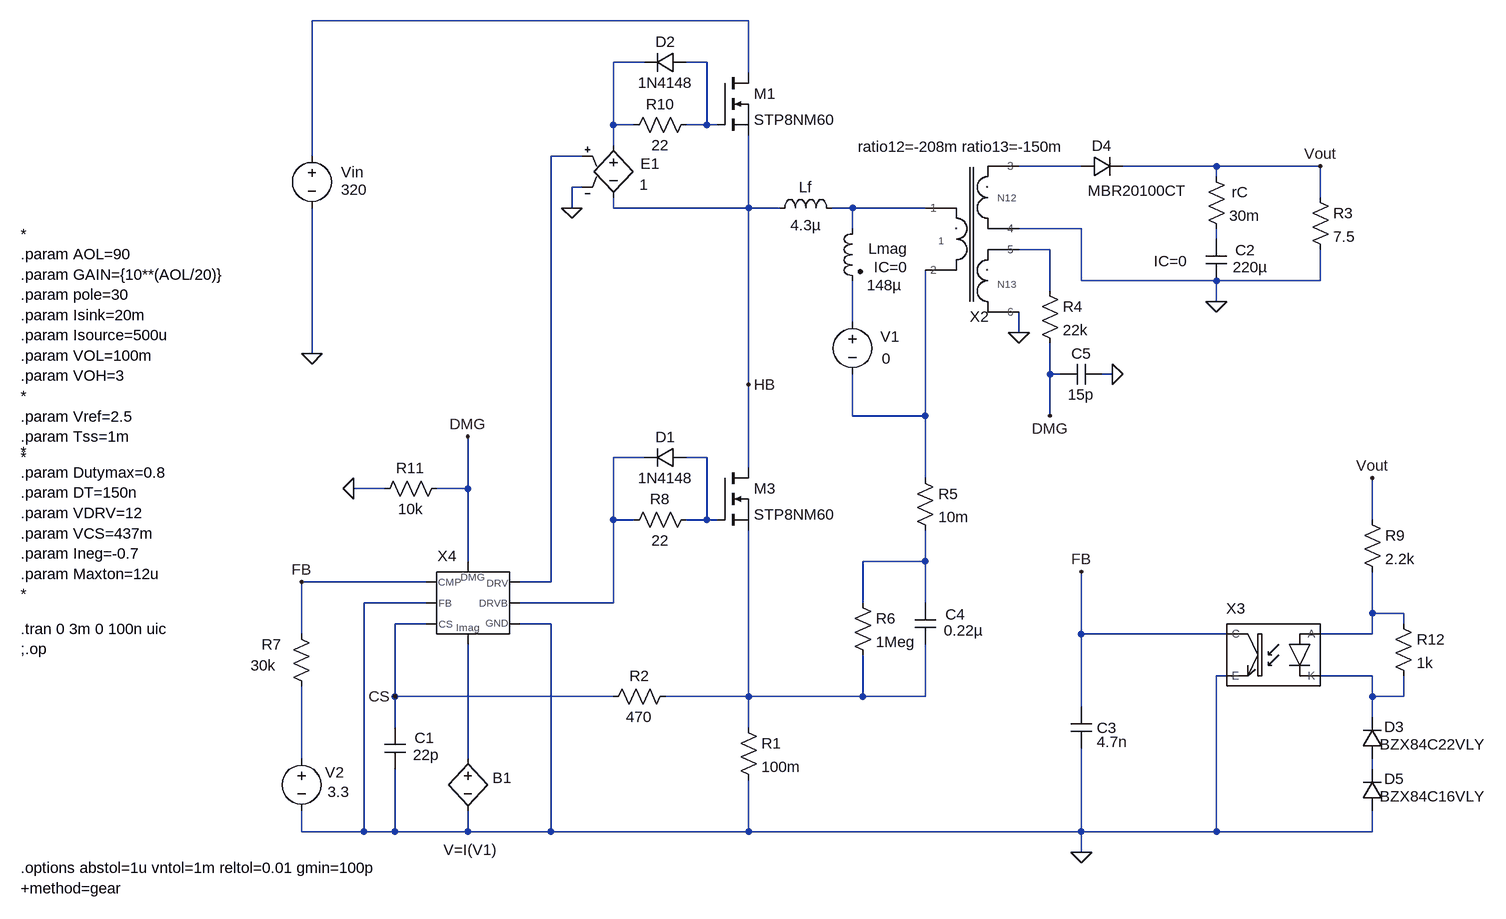
[diagram p0: schematic Flyback CM - AHB - isolated Zener - 45 V - MOSFETs - cbc.asc]
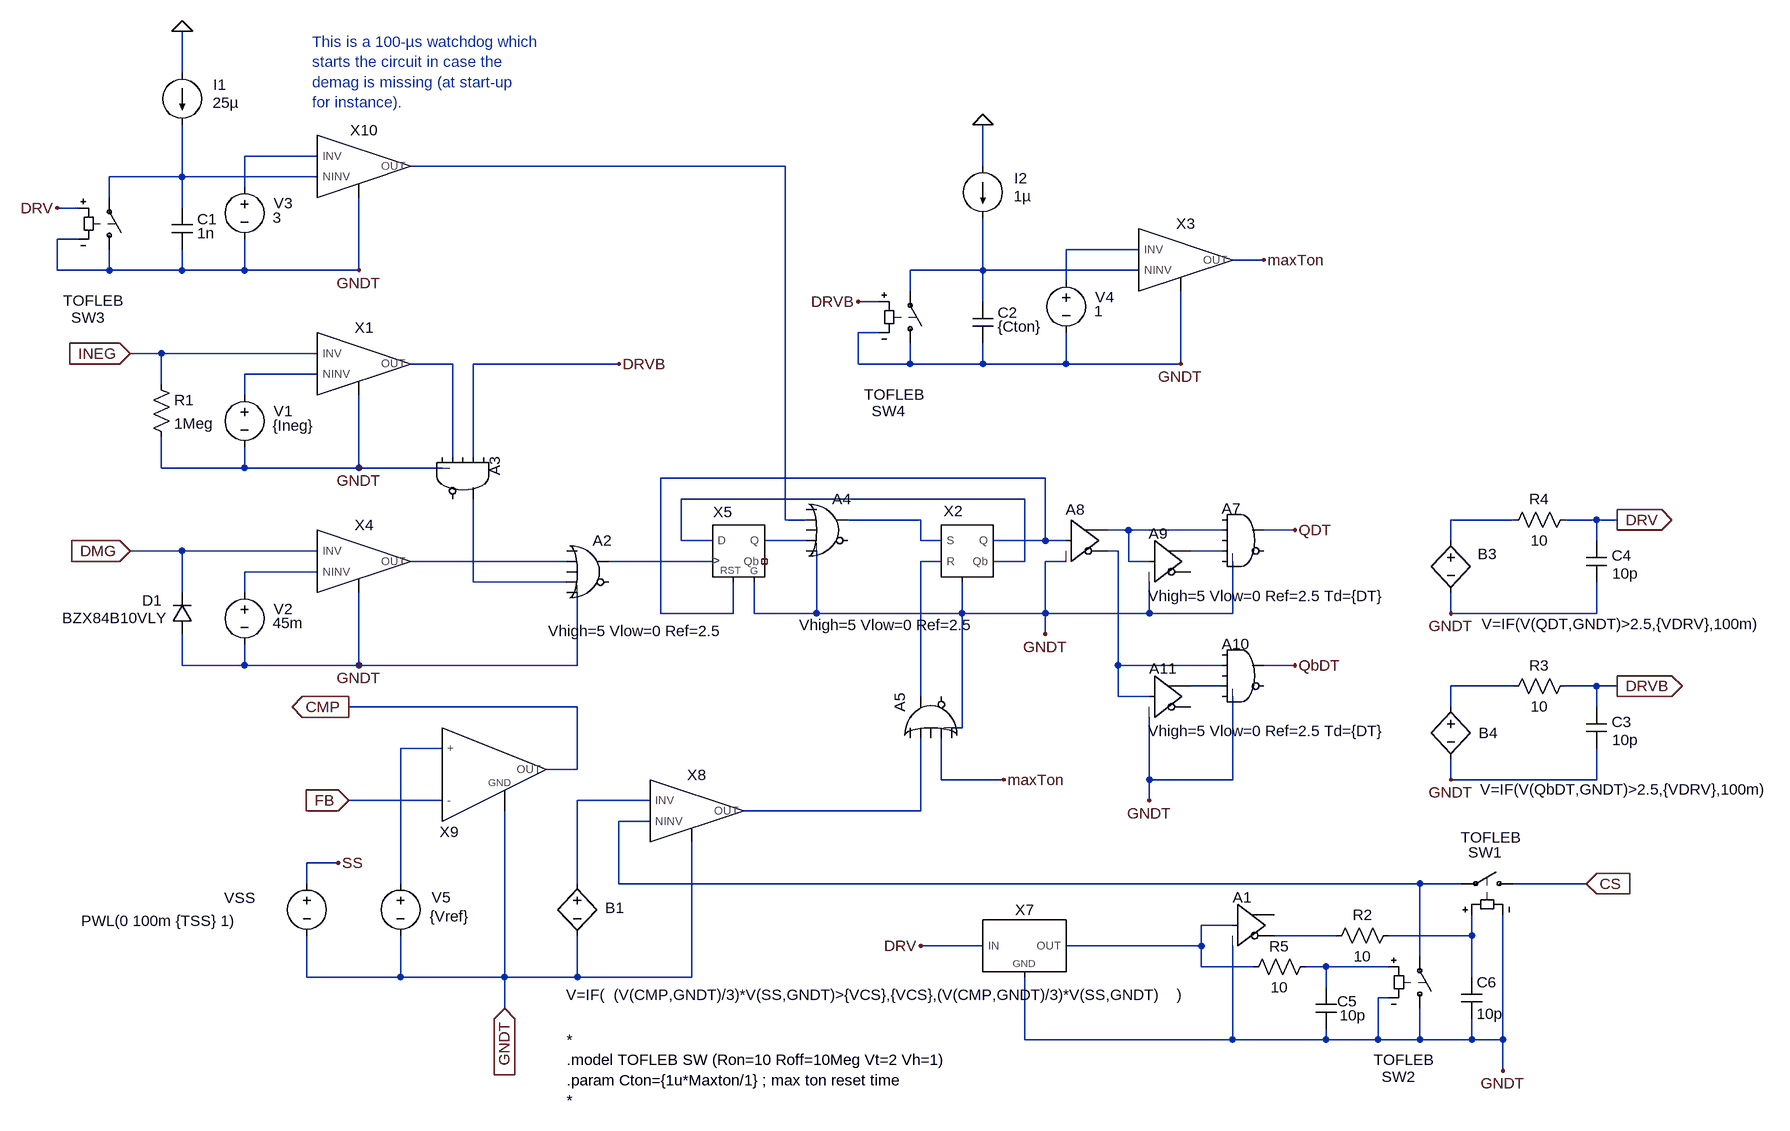
[diagram p1: sub-circuit generic_cm_qr_ahb_pwm.asc]
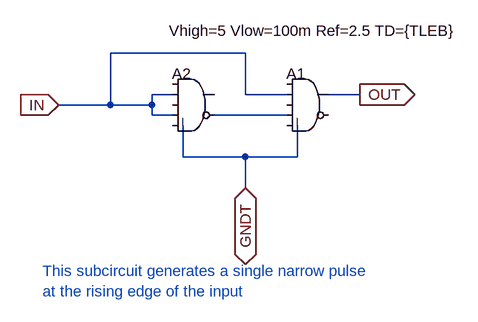
[diagram p2: sub-circuit small_pulse_leb.asc]
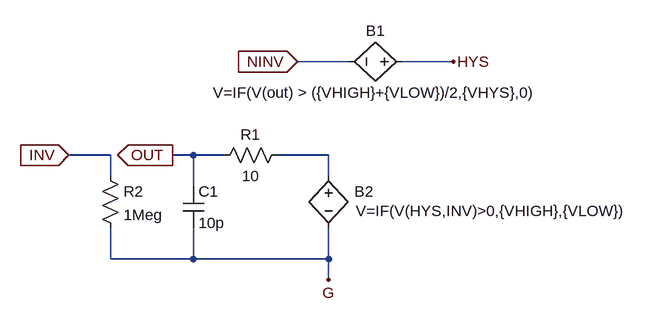
[diagram p3: sub-circuit comptof_g.asc]
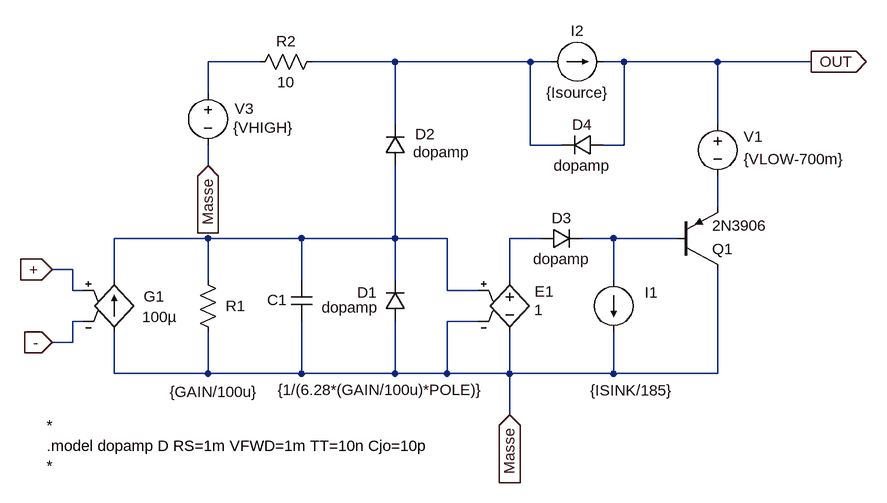
[diagram p4: sub-circuit op_amp_fan_out.asc]
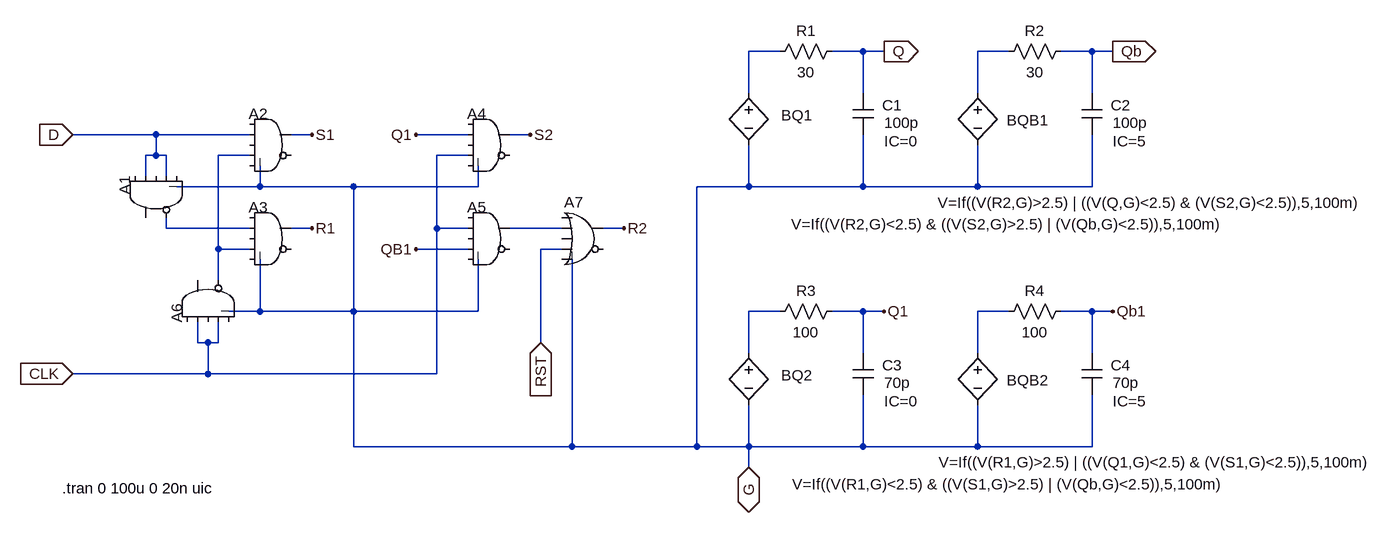
[diagram p5: sub-circuit d_flipflop_g_rst.asc]
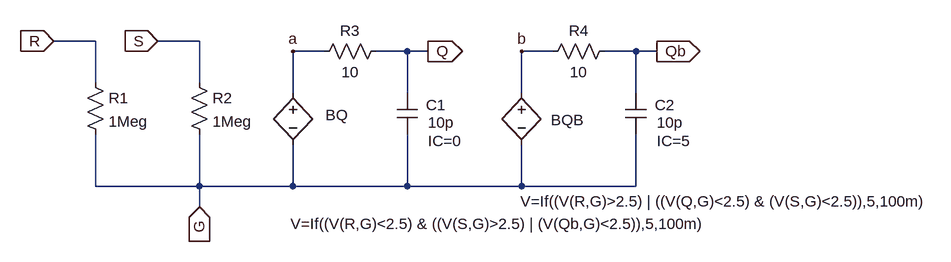
[diagram p6: sub-circuit sr_latch_g.asc]
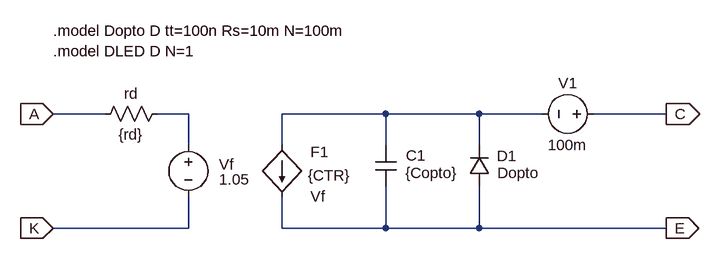
[diagram p7: sub-circuit optotof.asc]
Flyback CM - AHB - isolated Zener - 45 V - MOSFETs - cbc.asc, the LTspice schematic file:
Version 4.1
SHEET 1 3452 1760
WIRE 176 -512 -496 -512
WIRE 16 -448 -32 -448
WIRE 112 -448 80 -448
WIRE 176 -432 176 -512
WIRE -32 -352 -32 -448
WIRE 0 -352 -32 -352
WIRE 112 -352 112 -448
WIRE 112 -352 80 -352
WIRE 128 -352 112 -352
WIRE -32 -320 -32 -352
WIRE -496 -304 -496 -512
WIRE -80 -304 -128 -304
WIRE 688 -288 592 -288
WIRE 896 -288 752 -288
WIRE 1056 -288 896 -288
WIRE 896 -272 896 -288
WIRE -80 -256 -96 -256
WIRE 1056 -240 1056 -288
WIRE -96 -224 -96 -256
WIRE -32 -224 -32 -240
WIRE 176 -224 176 -336
WIRE 176 -224 -32 -224
WIRE 224 -224 176 -224
WIRE 336 -224 304 -224
WIRE 448 -224 336 -224
WIRE 336 -192 336 -224
WIRE 688 -192 592 -192
WIRE 896 -176 896 -192
WIRE 640 -160 592 -160
WIRE 688 -112 688 -192
WIRE 896 -112 688 -112
WIRE 1056 -112 1056 -160
WIRE 1056 -112 896 -112
WIRE 640 -96 640 -160
WIRE 896 -80 896 -112
WIRE 336 -48 336 -112
WIRE 592 -32 592 -64
WIRE -496 0 -496 -224
WIRE 640 32 640 -16
WIRE 656 32 640 32
WIRE 736 32 720 32
WIRE 176 48 176 -224
WIRE 336 96 336 32
WIRE 448 96 448 -128
WIRE 448 96 336 96
WIRE 640 96 640 32
WIRE 16 160 -32 160
WIRE 112 160 80 160
WIRE 176 176 176 48
WIRE 448 192 448 96
WIRE -384 208 -432 208
WIRE -256 208 -256 128
WIRE -256 208 -304 208
WIRE -32 256 -32 160
WIRE 0 256 -32 256
WIRE 112 256 112 160
WIRE 112 256 80 256
WIRE 128 256 112 256
WIRE 1136 256 1136 192
WIRE -256 320 -256 208
WIRE 448 320 448 272
WIRE 448 320 352 320
WIRE -320 352 -512 352
WIRE -128 352 -128 -304
WIRE -128 352 -176 352
WIRE -320 384 -416 384
WIRE -32 384 -32 256
WIRE -32 384 -176 384
WIRE 352 384 352 320
WIRE 448 384 448 320
WIRE 1136 400 1136 336
WIRE 1184 400 1136 400
WIRE -320 416 -368 416
WIRE -128 416 -176 416
WIRE 1184 416 1184 400
WIRE -512 432 -512 352
WIRE 688 432 688 336
WIRE 912 432 688 432
WIRE 1136 432 1136 400
WIRE 1136 432 1056 432
WIRE 912 496 896 496
WIRE 1136 496 1056 496
WIRE -368 528 -368 416
WIRE -32 528 -368 528
WIRE 176 528 176 272
WIRE 176 528 48 528
WIRE 352 528 352 464
WIRE 352 528 176 528
WIRE 448 528 448 448
WIRE 448 528 352 528
WIRE 1136 528 1136 496
WIRE 1184 528 1184 496
WIRE 1184 528 1136 528
WIRE 688 544 688 432
WIRE 1136 560 1136 528
WIRE -368 576 -368 528
WIRE 176 576 176 528
WIRE -512 624 -512 512
WIRE -256 624 -256 448
WIRE 1136 640 1136 624
WIRE -512 736 -512 704
WIRE -416 736 -416 384
WIRE -416 736 -512 736
WIRE -368 736 -368 640
WIRE -368 736 -416 736
WIRE -256 736 -256 704
WIRE -256 736 -368 736
WIRE -128 736 -128 416
WIRE -128 736 -256 736
WIRE 176 736 176 656
WIRE 176 736 -128 736
WIRE 688 736 688 608
WIRE 688 736 176 736
WIRE 896 736 896 496
WIRE 896 736 688 736
WIRE 1136 736 1136 704
WIRE 1136 736 896 736
WIRE 688 768 688 736
FLAG 896 -80 0
FLAG -496 0 0
FLAG 1056 -288 Vout
FLAG 688 768 0
FLAG 688 336 FB
FLAG -512 352 FB
FLAG 592 -32 0
FLAG 640 96 DMG
FLAG -256 128 DMG
FLAG 736 32 0
FLAG 176 48 HB
FLAG -368 528 CS
FLAG -432 208 0
FLAG -96 -224 0
FLAG 1136 192 Vout
SYMBOL ind2 352 -208 M0
WINDOW 0 -69 47 Left 2
WINDOW 3 -60 103 Left 2
WINDOW 123 -69 75 Left 2
SYMATTR InstName Lmag
SYMATTR Value 148µ
SYMATTR Value2 IC=0
SYMATTR Type ind
SYMBOL res 880 -288 R0
WINDOW 0 40 40 Left 2
SYMATTR InstName rC
SYMATTR Value 30m
SYMBOL cap 880 -176 R0
WINDOW 0 45 17 Left 2
WINDOW 3 41 43 Left 2
WINDOW 123 -80 34 Left 2
SYMATTR InstName C2
SYMATTR Value 220µ
SYMATTR Value2 IC=0
SYMBOL res 1040 -256 R0
SYMATTR InstName R3
SYMATTR Value 7.5
SYMBOL voltage -496 -320 R0
WINDOW 0 45 41 Left 2
WINDOW 3 45 68 Left 2
SYMATTR InstName Vin
SYMATTR Value 320
SYMBOL res 432 176 R0
SYMATTR InstName R5
SYMATTR Value 10m
SYMBOL ind 208 -208 R270
WINDOW 0 32 56 VTop 2
WINDOW 3 5 56 VBottom 2
SYMATTR InstName Lf
SYMATTR Value 4.3µ
SYMBOL voltage -512 608 R0
WINDOW 0 36 37 Left 2
WINDOW 3 40 67 Left 2
SYMATTR InstName V2
SYMATTR Value 3.3
SYMBOL res -528 416 R0
WINDOW 3 -62 64 Left 2
WINDOW 0 -45 32 Left 2
SYMATTR Value 30k
SYMATTR InstName R7
SYMBOL cap 672 544 R0
WINDOW 0 40 32 Left 2
WINDOW 3 40 54 Left 2
SYMATTR InstName C3
SYMATTR Value 4.7n
SYMBOL diode 688 -272 R270
WINDOW 0 32 32 VTop 2
WINDOW 3 -6 87 VBottom 2
SYMATTR InstName D4
SYMATTR Value MBR20100CT
SYMBOL res 160 560 R0
SYMATTR InstName R1
SYMATTR Value 100m
SYMBOL res 64 512 R90
WINDOW 0 0 56 VBottom 2
WINDOW 3 32 56 VTop 2
SYMATTR InstName R2
SYMATTR Value 470
SYMBOL cap -384 576 R0
WINDOW 0 46 16 Left 2
WINDOW 3 44 42 Left 2
SYMATTR InstName C1
SYMATTR Value 22p
SYMBOL res 624 -112 R0
SYMATTR InstName R4
SYMATTR Value 22k
SYMBOL cap 720 16 R90
WINDOW 0 0 32 VBottom 2
WINDOW 3 32 32 VTop 2
SYMATTR InstName C5
SYMATTR Value 15p
SYMBOL voltage 336 -64 R0
WINDOW 0 43 38 Left 2
WINDOW 3 45 72 Left 2
SYMATTR InstName V1
SYMATTR Value 0
SYMBOL bv -256 608 R0
WINDOW 0 38 45 Left 2
WINDOW 3 -37 156 Left 2
SYMATTR InstName B1
SYMATTR Value V=I(V1)
SYMBOL nmos 128 -432 R0
SYMATTR InstName M1
SYMATTR Value STP8NM60
SYMBOL res 96 240 R90
WINDOW 0 0 56 VBottom 2
WINDOW 3 32 56 VTop 2
SYMATTR InstName R8
SYMATTR Value 22
SYMBOL diode 80 176 M270
WINDOW 0 32 32 VTop 2
WINDOW 3 0 32 VBottom 2
SYMATTR InstName D1
SYMATTR Value 1N4148
SYMBOL res 96 -368 R90
WINDOW 0 0 56 VBottom 2
WINDOW 3 32 56 VTop 2
SYMATTR InstName R10
SYMATTR Value 22
SYMBOL diode 80 -432 M270
WINDOW 0 32 32 VTop 2
WINDOW 3 0 32 VBottom 2
SYMATTR InstName D2
SYMATTR Value 1N4148
SYMBOL e -32 -336 R0
WINDOW 0 42 44 Left 2
WINDOW 3 40 76 Left 2
SYMATTR InstName E1
SYMATTR Value 1
SYMBOL nmos 128 176 R0
SYMATTR InstName M3
SYMATTR Value STP8NM60
SYMBOL res -288 192 R90
WINDOW 0 0 56 VBottom 2
WINDOW 3 32 56 VTop 2
SYMATTR InstName R11
SYMATTR Value 10k
SYMBOL res 336 368 R0
SYMATTR InstName R6
SYMATTR Value 1Meg
SYMBOL cap 432 384 R0
WINDOW 0 47 18 Left 2
WINDOW 3 45 42 Left 2
SYMATTR InstName C4
SYMATTR Value 0.22µ
SYMBOL res 1120 240 R0
SYMATTR InstName R9
SYMATTR Value 2.2k
SYMBOL res 1168 400 R0
SYMATTR InstName R12
SYMATTR Value 1k
SYMBOL diode 1152 624 R180
WINDOW 0 -33 49 Left 2
WINDOW 3 -158 22 Left 2
SYMATTR InstName D3
SYMATTR Value BZX84C22VLY
SYMBOL diode 1152 704 R180
WINDOW 0 -33 49 Left 2
WINDOW 3 -158 22 Left 2
SYMATTR InstName D5
SYMATTR Value BZX84C16VLY
SYMBOL TOF\\Subcircuits\\Generic_CM_QR_AHB_PWM -256 352 R0
WINDOW 0 -32 -25 Bottom 2
SYMATTR InstName X4
SYMATTR SpiceLine gain={gain} pole={pole} Isink={Isink} Isource={Isource} Vlow={VOL} Vhigh={VOH} Ineg={Ineg} Maxton={Maxton}
SYMBOL TOF\\Subcircuits\\optoTOF 944 464 M0
WINDOW 0 18 -56 Bottom 2
SYMATTR InstName X3
SYMATTR SpiceLine Copto=450p Rd=150 CTR=0.33
SYMBOL TOF\\Subcircuits\\XFMR_3W 480 -272 R0
WINDOW 0 51 231 Bottom 2
WINDOW 39 25 -31 Bottom 2
SYMATTR InstName X2
SYMATTR SpiceLine ratio12=-208m ratio13=-150m
TEXT -944 424 Left 2 !.tran 0 3m 0 100n uic\n;.op
TEXT -944 -184 Left 2 !* \n.param AOL=90\n.param GAIN={10**(AOL/20)}\n.param pole=30\n.param Isink=20m\n.param Isource=500u\n.param VOL=100m\n.param VOH=3\n*\n.param Vref=2.5\n.param Tss=1m\n*
TEXT -944 152 Left 2 !*\n.param Dutymax=0.8\n.param DT=150n\n.param VDRV=12\n.param VCS=437m\n.param Ineg=-0.7\n.param Maxton=12u\n*
TEXT -944 792 Left 2 !.options abstol=1u vntol=1m reltol=0.01 gmin=100p\n+method=gear

generic_cm_qr_ahb_pwm.asc, the sub-circuit schematic file:
Version 4.1
SHEET 1 1744 1808
WIRE -1456 128 -1456 64
WIRE -1248 256 -1360 256
WIRE -528 272 -1104 272
WIRE -224 272 -224 208
WIRE -1456 288 -1456 208
WIRE -1456 288 -1568 288
WIRE -1248 288 -1456 288
WIRE -1360 304 -1360 256
WIRE -1568 320 -1568 288
WIRE -1616 336 -1648 336
WIRE -1456 336 -1456 288
WIRE -1616 384 -1648 384
WIRE 16 400 -96 400
WIRE 208 416 160 416
WIRE -1648 432 -1648 384
WIRE -1568 432 -1568 400
WIRE -1568 432 -1648 432
WIRE -1456 432 -1456 400
WIRE -1456 432 -1568 432
WIRE -1360 432 -1360 384
WIRE -1360 432 -1456 432
WIRE -1184 432 -1184 320
WIRE -1184 432 -1360 432
WIRE -224 432 -224 352
WIRE -224 432 -336 432
WIRE 16 432 -224 432
WIRE -96 448 -96 400
WIRE -336 464 -336 432
WIRE -384 480 -416 480
WIRE -224 480 -224 432
WIRE -384 528 -416 528
WIRE -1488 560 -1536 560
WIRE -1248 560 -1488 560
WIRE -1040 576 -1104 576
WIRE -784 576 -1008 576
WIRE -416 576 -416 528
WIRE -336 576 -336 544
WIRE -336 576 -416 576
WIRE -224 576 -224 544
WIRE -224 576 -336 576
WIRE -96 576 -96 528
WIRE -96 576 -224 576
WIRE 80 576 80 464
WIRE 80 576 -96 576
WIRE -1248 592 -1360 592
WIRE -1488 608 -1488 560
WIRE -1360 624 -1360 592
WIRE -1040 720 -1040 576
WIRE -1008 720 -1008 576
WIRE -1488 736 -1488 688
WIRE -1360 736 -1360 704
WIRE -1360 736 -1488 736
WIRE -1184 736 -1184 624
WIRE -1184 736 -1360 736
WIRE -1056 736 -1184 736
WIRE -128 752 -720 752
WIRE -160 784 -688 784
WIRE -528 816 -528 272
WIRE -496 816 -528 816
WIRE -320 816 -432 816
WIRE 592 816 496 816
WIRE 720 816 672 816
WIRE 752 816 720 816
WIRE 0 832 -32 832
WIRE 144 832 0 832
WIRE 256 832 208 832
WIRE -688 848 -688 784
WIRE -640 848 -688 848
WIRE -496 848 -560 848
WIRE -320 848 -320 816
WIRE -288 848 -320 848
WIRE -128 848 -128 752
WIRE -128 848 -208 848
WIRE -96 848 -128 848
WIRE 496 848 496 816
WIRE 720 848 720 816
WIRE -1456 864 -1536 864
WIRE -1248 864 -1456 864
WIRE -16 864 -32 864
WIRE 144 864 96 864
WIRE -864 880 -1104 880
WIRE -640 880 -800 880
WIRE -288 880 -320 880
WIRE -160 880 -160 784
WIRE -160 880 -208 880
WIRE -96 880 -128 880
WIRE 0 880 0 832
WIRE 32 880 0 880
WIRE -1248 896 -1360 896
WIRE -1008 912 -1008 784
WIRE -864 912 -1008 912
WIRE -1456 928 -1456 864
WIRE -1360 928 -1360 896
WIRE -720 960 -720 752
WIRE -608 960 -608 912
WIRE -608 960 -720 960
WIRE -576 960 -576 912
WIRE -480 960 -480 864
WIRE -480 960 -576 960
WIRE -256 960 -256 912
WIRE -256 960 -480 960
WIRE -128 960 -128 880
WIRE -128 960 -256 960
WIRE 32 960 32 912
WIRE 32 960 -128 960
WIRE 160 960 160 880
WIRE 160 960 32 960
WIRE 496 960 496 928
WIRE 720 960 720 912
WIRE 720 960 496 960
WIRE -128 992 -128 960
WIRE -1456 1040 -1456 992
WIRE -1360 1040 -1360 1008
WIRE -1360 1040 -1456 1040
WIRE -1184 1040 -1184 928
WIRE -1184 1040 -1360 1040
WIRE -848 1040 -848 928
WIRE -848 1040 -1184 1040
WIRE -16 1040 -16 864
WIRE 144 1040 -16 1040
WIRE 256 1040 208 1040
WIRE 144 1072 96 1072
WIRE 592 1072 496 1072
WIRE 720 1072 672 1072
WIRE 752 1072 720 1072
WIRE -320 1088 -320 880
WIRE -16 1088 -16 1040
WIRE 32 1088 -16 1088
WIRE -848 1104 -1200 1104
WIRE 496 1104 496 1072
WIRE 720 1104 720 1072
WIRE -256 1136 -256 960
WIRE -256 1136 -272 1136
WIRE -1056 1168 -1120 1168
WIRE -848 1200 -848 1104
WIRE -848 1200 -896 1200
WIRE -288 1216 -288 1152
WIRE -192 1216 -288 1216
WIRE 32 1216 32 1120
WIRE 160 1216 160 1088
WIRE 160 1216 32 1216
WIRE 496 1216 496 1184
WIRE 720 1216 720 1168
WIRE 720 1216 496 1216
WIRE -1056 1248 -1200 1248
WIRE -736 1248 -848 1248
WIRE 32 1248 32 1216
WIRE -320 1264 -320 1152
WIRE -320 1264 -592 1264
WIRE -736 1280 -784 1280
WIRE -1216 1344 -1264 1344
WIRE -1264 1376 -1264 1344
WIRE -1120 1376 -1120 1168
WIRE -848 1376 -848 1248
WIRE -784 1376 -784 1280
WIRE 448 1376 -784 1376
WIRE 512 1376 448 1376
WIRE 704 1376 592 1376
WIRE 160 1440 112 1440
WIRE 320 1456 224 1456
WIRE 528 1456 528 1424
WIRE 528 1456 400 1456
WIRE -224 1472 -320 1472
WIRE 112 1472 112 1440
WIRE 112 1472 -96 1472
WIRE 448 1488 448 1376
WIRE 112 1504 112 1472
WIRE 192 1504 112 1504
WIRE 304 1504 272 1504
WIRE 400 1504 304 1504
WIRE -1264 1520 -1264 1456
WIRE -1120 1520 -1120 1456
WIRE -1120 1520 -1264 1520
WIRE -960 1520 -960 1264
WIRE -960 1520 -1120 1520
WIRE -848 1520 -848 1456
WIRE -848 1520 -960 1520
WIRE -672 1520 -672 1312
WIRE -672 1520 -848 1520
WIRE 528 1520 528 1456
WIRE 304 1536 304 1504
WIRE 400 1552 384 1552
WIRE -960 1568 -960 1520
WIRE -160 1616 -160 1520
WIRE 160 1616 160 1472
WIRE 160 1616 -160 1616
WIRE 304 1616 304 1600
WIRE 304 1616 160 1616
WIRE 384 1616 384 1552
WIRE 384 1616 304 1616
WIRE 448 1616 448 1568
WIRE 448 1616 384 1616
WIRE 528 1616 528 1584
WIRE 528 1616 448 1616
WIRE 576 1616 576 1424
WIRE 576 1616 528 1616
WIRE 576 1664 576 1616
FLAG 256 832 QDT
FLAG 256 1040 QbDT
FLAG 496 1216 GNDT
FLAG 496 960 GNDT
FLAG 752 1072 DRVB
IOPIN 752 1072 Out
FLAG 752 816 DRV
IOPIN 752 816 Out
FLAG -1200 1104 CMP
IOPIN -1200 1104 Out
FLAG -1200 1248 FB
IOPIN -1200 1248 In
FLAG 704 1376 CS
IOPIN 704 1376 In
FLAG -960 1568 GNDT
IOPIN -960 1568 In
FLAG 32 1248 GNDT
FLAG -128 992 GNDT
FLAG -1536 864 DMG
IOPIN -1536 864 In
FLAG -1184 1040 GNDT
FLAG 576 1664 GNDT
FLAG -320 1472 DRV
FLAG -1184 736 GNDT
FLAG -1536 560 INEG
IOPIN -1536 560 In
FLAG -784 576 DRVB
FLAG -1184 432 GNDT
FLAG -1456 64 0
FLAG -1648 336 DRV
FLAG -1216 1344 SS
FLAG 80 576 GNDT
FLAG -224 208 0
FLAG -416 480 DRVB
FLAG 208 416 maxTon
FLAG -192 1216 maxTon
SYMBOL Digital\\and 176 784 R0
WINDOW 0 -33 15 Left 2
SYMATTR InstName A7
SYMATTR SpiceLine Vhigh=5 Vlow=0 Ref=2.5
SYMBOL Digital\\buf -96 784 R0
WINDOW 0 -1 16 Left 2
SYMATTR InstName A8
SYMATTR SpiceLine Vhigh=5 Vlow=0 Ref=1.0
SYMBOL Digital\\buf 32 816 R0
WINDOW 0 -1 21 Left 2
WINDOW 39 -2 117 Left 2
SYMATTR InstName A9
SYMATTR SpiceLine Vhigh=5 Vlow=0 Ref=2.5 Td={DT}
SYMBOL Digital\\and 176 992 R0
WINDOW 0 -33 15 Left 2
SYMATTR InstName A10
SYMATTR SpiceLine Vhigh=5 Vlow=0 Ref=2.5
SYMBOL Digital\\buf 32 1024 R0
WINDOW 0 0 21 Left 2
WINDOW 39 -2 117 Left 2
SYMATTR InstName A11
SYMATTR SpiceLine Vhigh=5 Vlow=0 Ref=2.5 Td={DT}
SYMBOL bv 496 832 R0
WINDOW 0 41 37 Left 2
WINDOW 3 47 144 Left 2
SYMATTR InstName B3
SYMATTR Value V=IF(V(QDT,GNDT)>2.5,{VDRV},100m)
SYMBOL bv 496 1088 R0
WINDOW 0 43 56 Left 2
WINDOW 3 45 143 Left 2
SYMATTR InstName B4
SYMATTR Value V=IF(V(QbDT,GNDT)>2.5,{VDRV},100m)
SYMBOL res 688 1056 R90
WINDOW 0 0 56 VBottom 2
WINDOW 3 32 56 VTop 2
SYMATTR InstName R3
SYMATTR Value 10
SYMBOL cap 704 1104 R0
WINDOW 0 39 23 Left 2
WINDOW 3 40 51 Left 2
SYMATTR InstName C3
SYMATTR Value 10p
SYMBOL res 688 800 R90
WINDOW 0 0 56 VBottom 2
WINDOW 3 32 56 VTop 2
SYMATTR InstName R4
SYMATTR Value 10
SYMBOL cap 704 848 R0
WINDOW 0 39 23 Left 2
WINDOW 3 40 51 Left 2
SYMATTR InstName C4
SYMATTR Value 10p
SYMBOL voltage -1120 1360 R0
WINDOW 0 48 37 Left 2
WINDOW 3 45 66 Left 2
SYMATTR InstName V5
SYMATTR Value {Vref}
SYMBOL bv -848 1360 R0
WINDOW 0 43 53 Left 2
WINDOW 3 -17 187 Left 2
SYMATTR InstName B1
SYMATTR Value V=IF(  (V(CMP,GNDT)/3)*V(SS,GNDT)>{VCS},{VCS},(V(CMP,GNDT)/3)*V(SS,GNDT)    )
SYMBOL voltage -1360 912 R0
WINDOW 0 45 41 Left 2
WINDOW 3 43 63 Left 2
SYMATTR InstName V2
SYMATTR Value 45m
SYMBOL diode -1440 992 R180
WINDOW 0 47 52 Left 2
WINDOW 3 39 25 Left 2
SYMATTR InstName D1
SYMATTR Value BZX84B10VLY
SYMBOL sw 608 1376 M270
WINDOW 3 71 3 VRight 2
WINDOW 0 48 34 VRight 2
SYMATTR Value TOFLEB
SYMATTR InstName SW1
SYMBOL sw 448 1584 M180
WINDOW 3 23 -63 Right 2
WINDOW 0 -7 -89 Right 2
SYMATTR Value TOFLEB
SYMATTR InstName SW2
SYMBOL Digital\\buf 160 1376 R0
WINDOW 0 0 21 Left 2
SYMATTR InstName A1
SYMATTR SpiceLine Vhigh=5 Vlow=0 Ref=2.5
SYMBOL voltage -1360 608 R0
WINDOW 0 45 41 Left 2
WINDOW 3 43 63 Left 2
SYMATTR InstName V1
SYMATTR Value {Ineg}
SYMBOL res -1504 592 R0
SYMATTR InstName R1
SYMATTR Value 1Meg
SYMBOL Digital\\or -832 832 R0
WINDOW 39 -61 155 Left 2
SYMATTR SpiceLine Vhigh=5 Vlow=0 Ref=2.5
SYMATTR InstName A2
SYMBOL Digital\\and -960 752 R90
WINDOW 0 -33 15 Left 2
SYMATTR InstName A3
SYMATTR SpiceLine Vhigh=5 Vlow=0 Ref=2.5
SYMBOL Tof\\Subcircuits\\Small_pulse_LEB -160 1472 R0
SYMATTR InstName X7
SYMATTR SpiceLine Tleb=100n
SYMBOL voltage -1360 288 R0
WINDOW 0 45 41 Left 2
WINDOW 3 43 63 Left 2
SYMATTR InstName V3
SYMATTR Value 3
SYMBOL current -1456 128 R0
WINDOW 0 48 18 Left 2
WINDOW 3 47 46 Left 2
SYMATTR InstName I1
SYMATTR Value 25µ
SYMBOL cap -1472 336 R0
WINDOW 0 39 17 Left 2
WINDOW 3 39 39 Left 2
SYMATTR InstName C1
SYMATTR Value 1n
SYMBOL sw -1568 416 M180
WINDOW 3 23 -63 Right 2
WINDOW 0 -7 -89 Right 2
SYMATTR Value TOFLEB
SYMATTR InstName SW3
SYMBOL Digital\\or -464 768 R0
WINDOW 39 -43 210 Left 2
SYMATTR SpiceLine Vhigh=5 Vlow=0 Ref=2.5
SYMATTR InstName A4
SYMBOL voltage -1264 1360 R0
WINDOW 0 -127 38 Left 2
WINDOW 3 -347 73 Left 2
WINDOW 123 0 0 Left 0
WINDOW 39 0 0 Left 0
SYMATTR InstName VSS
SYMATTR Value PWL(0 100m {TSS} 1)
SYMBOL voltage -96 432 R0
WINDOW 0 45 41 Left 2
WINDOW 3 43 63 Left 2
SYMATTR InstName V4
SYMATTR Value 1
SYMBOL current -224 272 R0
WINDOW 0 48 18 Left 2
WINDOW 3 47 46 Left 2
SYMATTR InstName I2
SYMATTR Value 1µ
SYMBOL cap -240 480 R0
WINDOW 0 39 17 Left 2
WINDOW 3 39 39 Left 2
SYMATTR InstName C2
SYMATTR Value {Cton}
SYMBOL sw -336 560 M180
WINDOW 3 23 -63 Right 2
WINDOW 0 -7 -89 Right 2
SYMATTR Value TOFLEB
SYMATTR InstName SW4
SYMBOL Digital\\or -368 1120 R270
SYMATTR SpiceLine Vhigh=5 Vlow=0 Ref=2.5 Td=100n
SYMATTR InstName A5
SYMBOL res 416 1440 R90
WINDOW 0 0 56 VBottom 2
WINDOW 3 32 56 VTop 2
SYMATTR InstName R2
SYMATTR Value 10
SYMBOL res 288 1488 R90
WINDOW 0 0 56 VBottom 2
WINDOW 3 32 56 VTop 2
SYMATTR InstName R5
SYMATTR Value 10
SYMBOL cap 288 1536 R0
WINDOW 0 33 21 Left 2
WINDOW 3 37 43 Left 2
SYMATTR InstName C5
SYMATTR Value 10p
SYMBOL cap 512 1520 R0
SYMATTR InstName C6
SYMATTR Value 10p
SYMBOL TOF\\Subcircuits\\COMPTOF_G -1184 272 R0
SYMATTR InstName X10
SYMATTR SpiceLine VHIGH=5 VLOW=100m VHYS=10m
SYMBOL TOF\\Subcircuits\\COMPTOF_G -1184 576 R0
SYMATTR InstName X1
SYMATTR SpiceLine VHIGH=5 VLOW=100m VHYS=10m
SYMBOL TOF\\Subcircuits\\COMPTOF_G -1184 880 R0
SYMATTR InstName X4
SYMATTR SpiceLine VHIGH=5 VLOW=100m VHYS=20m
SYMBOL TOF\\Subcircuits\\COMPTOF_G 80 416 R0
SYMATTR InstName X3
SYMATTR SpiceLine VHIGH=5 VLOW=100m VHYS=10m
SYMBOL TOF\\Subcircuits\\COMPTOF_G -672 1264 R0
SYMATTR InstName X8
SYMATTR SpiceLine VHIGH=5 VLOW=100m VHYS=10m
SYMBOL TOF\\Subcircuits\\op_amp_fan_out -976 1200 R0
WINDOW 0 -69 112 Bottom 2
SYMATTR InstName X9
SYMATTR SpiceLine gain={gain} pole={pole} Isink={Isink} Isource={Isource} Vlow={VOL} Vhigh={VOH}
SYMBOL TOF\\Subcircuits\\D_FlipFlop_G_RST -608 864 R0
WINDOW 0 -16 -44 Bottom 2
SYMATTR InstName X5
SYMBOL TOF\\Subcircuits\\SR_latch_G -256 864 R0
WINDOW 0 -14 -46 Bottom 2
SYMATTR InstName X2
TEXT -864 1616 Left 2 !*\n.model TOFLEB SW (Ron=10 Roff=10Meg Vt=2 Vh=1)\n.param Cton={1u*Maxton/1} ; max ton reset time\n*
TEXT -1256 80 Left 2 ;This is a 100-µs watchdog which\nstarts the circuit in case the\ndemag is missing (at start-up\nfor instance).

small_pulse_leb.asc, the sub-circuit schematic file:
Version 4.1
SHEET 1 880 680
WIRE 16 64 -192 64
WIRE -96 128 -128 128
WIRE 16 128 16 64
WIRE 80 128 16 128
WIRE 192 128 144 128
WIRE -192 144 -192 64
WIRE -192 144 -272 144
WIRE -128 144 -128 128
WIRE -128 144 -192 144
WIRE -128 160 -128 144
WIRE -96 160 -128 160
WIRE 80 160 -32 160
WIRE -80 224 -80 176
WIRE 16 224 -80 224
WIRE 96 224 96 176
WIRE 96 224 16 224
WIRE 16 272 16 224
FLAG 16 272 GNDT
IOPIN 16 272 BiDir
FLAG 192 128 OUT
IOPIN 192 128 Out
FLAG -272 144 IN
IOPIN -272 144 In
SYMBOL Digital\\and 112 80 R0
WINDOW 0 -33 16 Left 2
SYMATTR InstName A1
SYMATTR SpiceLine Vhigh=5 Vlow=100m Ref=2.5
SYMBOL Digital\\and -64 80 R0
WINDOW 0 -33 16 Left 2
WINDOW 39 -38 -50 Left 2
SYMATTR InstName A2
SYMATTR SpiceLine Vhigh=5 Vlow=100m Ref=2.5 TD={TLEB}
TEXT -296 400 Left 2 ;This subcircuit generates a single narrow pulse\nat the rising edge of the input

comptof_g.asc, the sub-circuit schematic file:
Version 4.1
SHEET 1 880 680
WIRE 64 192 -16 192
WIRE 224 192 144 192
WIRE -304 336 -368 336
WIRE -176 336 -208 336
WIRE -128 336 -176 336
WIRE 32 336 -48 336
WIRE -304 368 -304 336
WIRE 32 368 32 336
WIRE -176 384 -176 336
WIRE -304 496 -304 448
WIRE -176 496 -176 448
WIRE -176 496 -304 496
WIRE 32 496 32 448
WIRE 32 496 -176 496
WIRE 32 528 32 496
FLAG -16 192 NINV
IOPIN -16 192 In
FLAG 224 192 HYS
FLAG -208 336 OUT
IOPIN -208 336 Out
FLAG -368 336 INV
IOPIN -368 336 In
FLAG 32 528 G
SYMBOL bv 160 192 R90
WINDOW 0 -32 56 VBottom 2
WINDOW 3 32 56 VTop 2
SYMATTR InstName B1
SYMATTR Value V=IF(V(out) > ({VHIGH}+{VLOW})/2,{VHYS},0)
SYMBOL bv 32 352 R0
WINDOW 0 40 40 Left 2
WINDOW 3 42 70 Left 2
SYMATTR InstName B2
SYMATTR Value V=IF(V(HYS,INV)>0,{VHIGH},{VLOW})
SYMBOL res -32 320 R90
WINDOW 0 0 56 VBottom 2
WINDOW 3 32 56 VTop 2
SYMATTR InstName R1
SYMATTR Value 10
SYMBOL cap -192 384 R0
SYMATTR InstName C1
SYMATTR Value 10p
SYMBOL res -320 352 R0
SYMATTR InstName R2
SYMATTR Value 1Meg

op_amp_fan_out.asc, the sub-circuit schematic file:
Version 4.1
SHEET 1 1504 680
WIRE 96 -224 16 -224
WIRE 304 -224 176 -224
WIRE 512 -224 304 -224
WIRE 544 -224 512 -224
WIRE 656 -224 624 -224
WIRE 800 -224 656 -224
WIRE 944 -224 800 -224
WIRE 16 -176 16 -224
WIRE 304 -128 304 -224
WIRE 800 -128 800 -224
WIRE 512 -96 512 -224
WIRE 560 -96 512 -96
WIRE 656 -96 656 -224
WIRE 656 -96 624 -96
WIRE 16 -64 16 -96
WIRE 800 0 800 -48
WIRE 16 48 -128 48
WIRE 160 48 16 48
WIRE 304 48 304 -64
WIRE 304 48 160 48
WIRE 384 48 304 48
WIRE 528 48 480 48
WIRE 640 48 592 48
WIRE 736 48 640 48
WIRE -192 96 -224 96
WIRE -128 112 -128 48
WIRE 16 112 16 48
WIRE 160 112 160 48
WIRE 304 112 304 48
WIRE 480 112 480 48
WIRE 640 112 640 48
WIRE -192 128 -192 96
WIRE -176 128 -192 128
WIRE 384 128 384 48
WIRE 432 128 384 128
WIRE -176 176 -192 176
WIRE 432 176 384 176
WIRE -192 208 -192 176
WIRE -192 208 -224 208
WIRE -128 256 -128 192
WIRE 16 256 16 192
WIRE 16 256 -128 256
WIRE 160 256 160 176
WIRE 160 256 16 256
WIRE 304 256 304 176
WIRE 304 256 160 256
WIRE 384 256 384 176
WIRE 384 256 304 256
WIRE 480 256 480 192
WIRE 480 256 384 256
WIRE 640 256 640 192
WIRE 640 256 480 256
WIRE 800 256 800 96
WIRE 800 256 640 256
WIRE 480 320 480 256
FLAG -224 96 +
IOPIN -224 96 In
FLAG -224 208 -
IOPIN -224 208 In
FLAG 944 -224 OUT
IOPIN 944 -224 Out
FLAG 480 320 Masse
IOPIN 480 320 In
FLAG 16 -64 Masse
IOPIN 16 -64 In
DATAFLAG 800 -16 ""
SYMBOL g -128 96 R0
WINDOW 0 45 41 Left 2
WINDOW 3 43 73 Left 2
SYMATTR InstName G1
SYMATTR Value 100µ
SYMBOL res 0 96 R0
WINDOW 0 43 56 Left 2
WINDOW 3 -43 188 Left 2
SYMATTR InstName R1
SYMATTR Value {GAIN/100u}
SYMBOL cap 144 112 R0
WINDOW 0 -37 31 Left 2
WINDOW 3 -21 169 Left 2
SYMATTR InstName C1
SYMATTR Value {1/(6.28*(GAIN/100u)*POLE)}
SYMBOL diode 320 176 R180
WINDOW 0 44 45 Left 2
WINDOW 3 41 22 Left 2
SYMATTR InstName D1
SYMATTR Value dopamp
SYMBOL e 480 96 R0
WINDOW 0 39 34 Left 2
WINDOW 3 38 62 Left 2
SYMATTR InstName E1
SYMATTR Value 1
SYMBOL diode 528 64 R270
WINDOW 0 32 32 VTop 2
WINDOW 3 0 32 VBottom 2
SYMATTR InstName D3
SYMATTR Value dopamp
SYMBOL current 640 112 R0
WINDOW 0 48 19 Left 2
WINDOW 3 -36 170 Left 2
SYMATTR InstName I1
SYMATTR Value {ISINK/185}
SYMBOL pnp 736 96 M180
SYMATTR InstName Q1
SYMATTR Value 2N3906
SYMBOL voltage 800 -144 R0
WINDOW 0 40 35 Left 2
WINDOW 3 40 70 Left 2
SYMATTR InstName V1
SYMATTR Value {VLOW-700m}
SYMBOL current 544 -224 R270
WINDOW 0 32 40 VTop 2
WINDOW 3 -32 40 VBottom 2
SYMATTR InstName I2
SYMATTR Value {Isource}
SYMBOL diode 624 -80 M270
WINDOW 0 32 32 VTop 2
WINDOW 3 0 32 VBottom 2
SYMATTR InstName D4
SYMATTR Value dopamp
SYMBOL voltage 16 -192 R0
WINDOW 0 41 40 Left 2
WINDOW 3 39 69 Left 2
SYMATTR InstName V3
SYMATTR Value {VHIGH}
SYMBOL diode 288 -64 M180
WINDOW 0 47 49 Left 2
WINDOW 3 44 21 Left 2
SYMATTR InstName D2
SYMATTR Value dopamp
SYMBOL res 192 -240 R90
WINDOW 0 0 56 VBottom 2
WINDOW 3 32 56 VTop 2
SYMATTR InstName R2
SYMATTR Value 10
TEXT -232 336 Left 2 !*\n.model dopamp D RS=1m VFWD=1m TT=10n Cjo=10p\n*

d_flipflop_g_rst.asc, the sub-circuit schematic file:
Version 4.1
SHEET 1 1472 916
WIRE 480 -288 432 -288
WIRE 608 -288 560 -288
WIRE 640 -288 608 -288
WIRE 832 -288 784 -288
WIRE 960 -288 912 -288
WIRE 992 -288 960 -288
WIRE 432 -224 432 -288
WIRE 608 -224 608 -288
WIRE 784 -224 784 -288
WIRE 960 -224 960 -288
WIRE -480 -160 -608 -160
WIRE -336 -160 -480 -160
WIRE -240 -160 -272 -160
WIRE 0 -160 -80 -160
WIRE 96 -160 64 -160
WIRE -480 -128 -480 -160
WIRE -480 -128 -496 -128
WIRE -464 -128 -480 -128
WIRE -336 -128 -384 -128
WIRE 0 -128 -48 -128
WIRE -496 -96 -496 -128
WIRE -464 -96 -464 -128
WIRE -320 -80 -320 -112
WIRE -320 -80 -448 -80
WIRE -176 -80 -320 -80
WIRE 16 -80 16 -112
WIRE 16 -80 -176 -80
WIRE 432 -80 432 -144
WIRE 432 -80 352 -80
WIRE 608 -80 608 -160
WIRE 608 -80 432 -80
WIRE 784 -80 784 -144
WIRE 784 -80 608 -80
WIRE 960 -80 960 -160
WIRE 960 -80 784 -80
WIRE -464 -16 -464 -32
WIRE -336 -16 -464 -16
WIRE -240 -16 -272 -16
WIRE -48 -16 -48 -128
WIRE 0 -16 -48 -16
WIRE 144 -16 64 -16
WIRE 240 -16 208 -16
WIRE -384 16 -384 -128
WIRE -336 16 -384 16
WIRE 0 16 -80 16
WIRE 144 16 112 16
WIRE -384 64 -384 16
WIRE -320 112 -320 32
WIRE -320 112 -368 112
WIRE -176 112 -176 -80
WIRE -176 112 -320 112
WIRE 16 112 16 32
WIRE 16 112 -176 112
WIRE 480 112 432 112
WIRE 608 112 560 112
WIRE 640 112 608 112
WIRE 832 112 784 112
WIRE 960 112 912 112
WIRE 992 112 960 112
WIRE -416 160 -416 128
WIRE -400 160 -416 160
WIRE -384 160 -384 128
WIRE -384 160 -400 160
WIRE 112 160 112 16
WIRE 432 176 432 112
WIRE 608 176 608 112
WIRE 784 176 784 112
WIRE 960 176 960 112
WIRE -400 208 -400 160
WIRE -400 208 -608 208
WIRE -48 208 -48 -16
WIRE -48 208 -400 208
WIRE -176 320 -176 112
WIRE 160 320 160 32
WIRE 160 320 -176 320
WIRE 352 320 352 -80
WIRE 352 320 160 320
WIRE 432 320 432 256
WIRE 432 320 352 320
WIRE 608 320 608 240
WIRE 608 320 432 320
WIRE 784 320 784 256
WIRE 784 320 608 320
WIRE 960 320 960 240
WIRE 960 320 784 320
WIRE 432 352 432 320
FLAG -608 -160 D
IOPIN -608 -160 In
FLAG -608 208 CLK
IOPIN -608 208 In
FLAG 96 -160 S2
FLAG 240 -16 R2
FLAG 640 -288 Q
IOPIN 640 -288 Out
FLAG 992 -288 Qb
IOPIN 992 -288 Out
FLAG -240 -160 S1
FLAG -240 -16 R1
FLAG -80 -160 Q1
FLAG -80 16 QB1
FLAG 640 112 Q1
FLAG 992 112 Qb1
FLAG 432 352 G
IOPIN 432 352 BiDir
FLAG 112 160 RST
IOPIN 112 160 In
SYMBOL Digital\\and -544 -64 M90
WINDOW 0 -33 16 Left 2
SYMATTR InstName A1
SYMATTR SpiceLine Vhigh=5 Vlow=100m Ref=2.5 TD=10n
SYMBOL bv 432 -240 R0
WINDOW 0 50 50 Left 2
WINDOW 3 65 218 Left 2
SYMATTR InstName BQ1
SYMATTR Value V=If((V(R2,G)<2.5) & ((V(S2,G)>2.5) | (V(Qb,G)<2.5)),5,100m)
SYMBOL res 576 -304 R90
WINDOW 0 0 56 VBottom 2
WINDOW 3 32 56 VTop 2
SYMATTR InstName R1
SYMATTR Value 30
SYMBOL cap 592 -224 R0
WINDOW 0 45 19 Left 2
WINDOW 3 48 46 Left 2
WINDOW 123 48 74 Left 2
SYMATTR InstName C1
SYMATTR Value 100p
SYMATTR Value2 IC=0
SYMBOL bv 784 -240 R0
WINDOW 0 45 58 Left 2
WINDOW 3 -61 185 Left 2
SYMATTR InstName BQB1
SYMATTR Value V=If((V(R2,G)>2.5) | ((V(Q,G)<2.5) & (V(S2,G)<2.5)),5,100m)
SYMBOL res 928 -304 R90
WINDOW 0 0 56 VBottom 2
WINDOW 3 32 56 VTop 2
SYMATTR InstName R2
SYMATTR Value 30
SYMBOL cap 944 -224 R0
WINDOW 0 45 19 Left 2
WINDOW 3 48 46 Left 2
WINDOW 123 48 74 Left 2
SYMATTR InstName C2
SYMATTR Value 100p
SYMATTR Value2 IC=5
SYMBOL bv 432 160 R0
WINDOW 0 50 50 Left 2
WINDOW 3 67 218 Left 2
SYMATTR InstName BQ2
SYMATTR Value V=If((V(R1,G)<2.5) & ((V(S1,G)>2.5) | (V(Qb,G)<2.5)),5,100m)
SYMBOL res 576 96 R90
WINDOW 0 0 56 VBottom 2
WINDOW 3 32 56 VTop 2
SYMATTR InstName R3
SYMATTR Value 100
SYMBOL cap 592 176 R0
WINDOW 0 45 19 Left 2
WINDOW 3 48 46 Left 2
WINDOW 123 48 74 Left 2
SYMATTR InstName C3
SYMATTR Value 70p
SYMATTR Value2 IC=0
SYMBOL bv 784 160 R0
WINDOW 0 45 58 Left 2
WINDOW 3 -60 184 Left 2
SYMATTR InstName BQB2
SYMATTR Value V=If((V(R1,G)>2.5) | ((V(Q1,G)<2.5) & (V(S1,G)<2.5)),5,100m)
SYMBOL res 928 96 R90
WINDOW 0 0 56 VBottom 2
WINDOW 3 32 56 VTop 2
SYMATTR InstName R4
SYMATTR Value 100
SYMBOL cap 944 176 R0
WINDOW 0 45 19 Left 2
WINDOW 3 48 46 Left 2
WINDOW 123 48 74 Left 2
SYMATTR InstName C4
SYMATTR Value 70p
SYMATTR Value2 IC=5
SYMBOL Digital\\and -304 -208 R0
WINDOW 0 -33 16 Left 2
SYMATTR InstName A2
SYMATTR SpiceLine Vhigh=5 Vlow=100m Ref=2.5 TD=10n
SYMBOL Digital\\and -304 -64 R0
WINDOW 0 -33 16 Left 2
SYMATTR InstName A3
SYMATTR SpiceLine Vhigh=5 Vlow=100m Ref=2.5 TD=10n
SYMBOL Digital\\and 32 -208 R0
WINDOW 0 -33 16 Left 2
SYMATTR InstName A4
SYMATTR SpiceLine Vhigh=5 Vlow=100m Ref=2.5 TD=10n
SYMBOL Digital\\and 32 -64 R0
WINDOW 0 -33 16 Left 2
SYMATTR InstName A5
SYMATTR SpiceLine Vhigh=5 Vlow=100m Ref=2.5 TD=10n
SYMBOL Digital\\and -464 96 R270
WINDOW 0 -33 16 Left 2
SYMATTR InstName A6
SYMATTR SpiceLine Vhigh=5 Vlow=100m Ref=2.5 TD=10n
SYMBOL Digital\\or 176 -64 R0
WINDOW 0 -28 8 Left 2
SYMATTR InstName A7
SYMATTR SpiceLine Vhigh=5 Vlow=0 Ref=2.5
TEXT -624 384 Left 2 !.tran 0 100u 0 20n uic

sr_latch_g.asc, the sub-circuit schematic file:
Version 4.1
SHEET 1 1168 680
WIRE -192 48 -256 48
WIRE -32 48 -96 48
WIRE 160 64 112 64
WIRE 288 64 240 64
WIRE 320 64 288 64
WIRE 512 64 464 64
WIRE 640 64 592 64
WIRE 672 64 640 64
WIRE -192 112 -192 48
WIRE -32 112 -32 48
WIRE 112 128 112 64
WIRE 288 128 288 64
WIRE 464 128 464 64
WIRE 640 128 640 64
WIRE -192 272 -192 192
WIRE -32 272 -32 192
WIRE -32 272 -192 272
WIRE 112 272 112 208
WIRE 112 272 -32 272
WIRE 288 272 288 192
WIRE 288 272 112 272
WIRE 464 272 464 208
WIRE 464 272 288 272
WIRE 640 272 640 192
WIRE 640 272 464 272
WIRE -32 304 -32 272
FLAG -256 48 R
IOPIN -256 48 In
FLAG -96 48 S
IOPIN -96 48 In
FLAG 320 64 Q
IOPIN 320 64 Out
FLAG 672 64 Qb
IOPIN 672 64 Out
FLAG 112 64 a
FLAG 464 64 b
FLAG -32 304 G
IOPIN -32 304 In
SYMBOL bv 112 112 R0
WINDOW 0 50 50 Left 2
WINDOW 3 -4 218 Left 2
SYMATTR InstName BQ
SYMATTR Value V=If((V(R,G)<2.5) & ((V(S,G)>2.5) | (V(Qb,G)<2.5)),5,100m)
SYMBOL res -208 96 R0
SYMATTR InstName R1
SYMATTR Value 1Meg
SYMBOL res -48 96 R0
SYMATTR InstName R2
SYMATTR Value 1Meg
SYMBOL res 256 48 R90
WINDOW 0 0 56 VBottom 2
WINDOW 3 32 56 VTop 2
SYMATTR InstName R3
SYMATTR Value 10
SYMBOL cap 272 128 R0
WINDOW 0 45 19 Left 2
WINDOW 3 48 46 Left 2
WINDOW 123 48 74 Left 2
SYMATTR InstName C1
SYMATTR Value 10p
SYMATTR Value2 IC=0
SYMBOL bv 464 112 R0
WINDOW 0 45 58 Left 2
WINDOW 3 -2 183 Left 2
SYMATTR InstName BQB
SYMATTR Value V=If((V(R,G)>2.5) | ((V(Q,G)<2.5) & (V(S,G)<2.5)),5,100m)
SYMBOL res 608 48 R90
WINDOW 0 0 56 VBottom 2
WINDOW 3 32 56 VTop 2
SYMATTR InstName R4
SYMATTR Value 10
SYMBOL cap 624 128 R0
WINDOW 0 45 19 Left 2
WINDOW 3 48 46 Left 2
WINDOW 123 48 74 Left 2
SYMATTR InstName C2
SYMATTR Value 10p
SYMATTR Value2 IC=5

optotof.asc, the sub-circuit schematic file:
Version 4
SHEET 1 892 680
WIRE -48 32 -128 32
WIRE 80 32 32 32
WIRE 384 32 224 32
WIRE 528 32 384 32
WIRE 624 32 528 32
WIRE 816 32 704 32
WIRE 80 80 80 32
WIRE 224 80 224 32
WIRE 384 80 384 32
WIRE 528 80 528 32
WIRE 80 208 80 160
WIRE 80 208 -128 208
WIRE 224 208 224 160
WIRE 384 208 384 144
WIRE 384 208 224 208
WIRE 528 208 528 144
WIRE 528 208 384 208
WIRE 816 208 528 208
FLAG -128 32 A
IOPIN -128 32 In
FLAG -128 208 K
IOPIN -128 208 In
FLAG 816 32 C
IOPIN 816 32 Out
FLAG 816 208 E
IOPIN 816 208 Out
SYMBOL f 224 80 R0
WINDOW 0 44 11 Left 2
WINDOW 3 40 47 Left 2
WINDOW 38 44 79 Left 2
SYMATTR InstName F1
SYMATTR Value {CTR}
SYMATTR SpiceModel Vf
SYMBOL res 48 16 R90
WINDOW 0 0 56 VBottom 2
WINDOW 3 32 56 VTop 2
SYMATTR InstName rd
SYMATTR Value {rd}
SYMBOL voltage 80 64 R0
WINDOW 0 47 46 Left 2
WINDOW 3 47 69 Left 2
WINDOW 123 0 0 Left 0
WINDOW 39 0 0 Left 0
SYMATTR InstName Vf
SYMATTR Value 1.05
SYMBOL voltage 720 32 R90
WINDOW 0 -32 56 VBottom 2
WINDOW 3 32 56 VTop 2
SYMATTR InstName V1
SYMATTR Value 100m
SYMBOL cap 368 80 R0
WINDOW 0 47 16 Left 2
WINDOW 3 46 43 Left 2
SYMATTR InstName C1
SYMATTR Value {Copto}
SYMBOL diode 512 144 M180
WINDOW 0 43 47 Left 2
WINDOW 3 44 21 Left 2
SYMATTR InstName D1
SYMATTR Value Dopto
TEXT -128 -96 Left 2 !.model Dopto D tt=100n Rs=10m N=100m\n.model DLED D N=1

xfmr_3w.asc, the sub-circuit schematic file:
Version 4.1
SHEET 1 880 680
WIRE 32 96 -48 96
WIRE 160 96 32 96
WIRE 368 96 304 96
WIRE 496 96 448 96
WIRE 624 96 576 96
WIRE 32 144 32 96
WIRE 160 144 160 96
WIRE 304 144 304 96
WIRE 32 288 32 224
WIRE 32 288 -48 288
WIRE 160 288 160 224
WIRE 160 288 32 288
WIRE 304 288 304 224
WIRE 624 288 304 288
WIRE 368 352 304 352
WIRE 496 352 448 352
WIRE 624 352 576 352
WIRE 304 400 304 352
WIRE 304 544 304 480
WIRE 624 544 304 544
FLAG 624 288 4
IOPIN 624 288 Out
FLAG 624 96 3
IOPIN 624 96 Out
FLAG -48 96 1
IOPIN -48 96 In
FLAG -48 288 2
IOPIN -48 288 In
FLAG 624 544 6
IOPIN 624 544 Out
FLAG 624 352 5
IOPIN 624 352 Out
SYMBOL bi 160 144 R0
WINDOW 0 45 39 Left 2
WINDOW 3 -320 182 Left 2
SYMATTR InstName B1
SYMATTR Value I=I(V1)*{ratio12}+I(V2)*{ratio13}
SYMBOL bv 304 128 R0
WINDOW 0 40 42 Left 2
WINDOW 3 40 70 Left 2
SYMATTR InstName B2
SYMATTR Value V=V(1,2)*{ratio12}
SYMBOL voltage 352 96 R270
WINDOW 0 32 56 VTop 2
WINDOW 3 -32 56 VBottom 2
WINDOW 123 0 0 Left 0
WINDOW 39 0 0 Left 0
SYMATTR InstName V1
SYMATTR Value 0
SYMBOL res 592 80 R90
WINDOW 0 0 56 VBottom 2
WINDOW 3 32 56 VTop 2
SYMATTR InstName R1
SYMATTR Value 1µ
SYMBOL res 16 128 R0
SYMATTR InstName R2
SYMATTR Value 1Meg
SYMBOL bv 304 384 R0
WINDOW 0 40 42 Left 2
WINDOW 3 40 70 Left 2
SYMATTR InstName B3
SYMATTR Value V=V(1,2)*{ratio13}
SYMBOL voltage 352 352 R270
WINDOW 0 32 56 VTop 2
WINDOW 3 -32 56 VBottom 2
WINDOW 123 0 0 Left 0
WINDOW 39 0 0 Left 0
SYMATTR InstName V2
SYMATTR Value 0
SYMBOL res 592 336 R90
WINDOW 0 0 56 VBottom 2
WINDOW 3 32 56 VTop 2
SYMATTR InstName R3
SYMATTR Value 1µ

The netlist it stands for:
* Flyback CM - AHB - isolated Zener - 45 V - MOSFETs - cbc.asc
Lmag N006 N009 148µ IC=0
rC Vout N007 30m
C2 N007 0 220µ IC=0
R3 Vout 0 7.5
Vin N001 0 320
R5 N010 N013 10m
Lf HB N006 4.3µ
V2 N017 0 3.3
R7 FB N017 30k
C3 FB 0 4.7n
D4 N005 Vout MBR20100CT
R1 N016 0 100m
R2 N016 CS 470
C1 CS 0 22p
R4 N008 DMG 22k
C5 0 DMG 15p
V1 N009 N010 0
B1 N018 0 V=I(V1)
M1 N001 N003 HB HB STP8NM60
R8 N012 N011 22
D1 N012 N011 1N4148
R10 N003 N002 22
D2 N003 N002 1N4148
E1 N002 HB N004 0 1
M3 HB N012 N016 N016 STP8NM60
R11 DMG 0 10k
R6 N013 N016 1Meg
C4 N013 N016 0.22µ
R9 Vout N014 2.2k
R12 N014 N015 1k
D3 N019 N015 BZX84C22VLY
D5 0 N019 BZX84C16VLY
X§X4 CS 0 0 FB N004 N011 DMG N018 generic_cm_qr_ahb_pwm params: gain={gain} pole={pole} Isink={Isink} Isource={Isource} Vlow={VOL} Vhigh={VOH} Ineg={Ineg} Maxton={Maxton}
X§X3 N014 N015 FB 0 optotof params: Copto=450p Rd=150 CTR=0.33
X§X2 N006 N010 N005 0 N008 0 xfmr_3w params: ratio12=-208m ratio13=-150m

* block symbol definitions
.subckt generic_cm_qr_ahb_pwm CS FB GNDT CMP DRV DRVB DMG INEG
A7 GNDT N012 GNDT N015 GNDT GNDT QDT GNDT AND Vhigh=5 Vlow=0 Ref=2.5
A8 N008 GNDT GNDT GNDT GNDT N014 N012 GNDT BUF Vhigh=5 Vlow=0 Ref=1.0
A9 N012 GNDT GNDT GNDT GNDT GNDT N015 GNDT BUF Vhigh=5 Vlow=0 Ref=2.5 Td={DT}
A10 GNDT N014 GNDT N021 GNDT GNDT QbDT GNDT AND Vhigh=5 Vlow=0 Ref=2.5
A11 N014 GNDT GNDT GNDT GNDT GNDT N021 GNDT BUF Vhigh=5 Vlow=0 Ref=2.5 Td={DT}
B3 N011 GNDT V=IF(V(QDT,GNDT)>2.5,{VDRV},100m)
B4 N022 GNDT V=IF(V(QbDT,GNDT)>2.5,{VDRV},100m)
R3 DRVB N022 10
C3 DRVB GNDT 10p
R4 DRV N011 10
C4 DRV GNDT 10p
V5 N023 GNDT {Vref}
B1 N024 GNDT V=IF(  (V(CMP,GNDT)/3)*V(SS,GNDT)>{VCS},{VCS},(V(CMP,GNDT)/3)*V(SS,GNDT)    )
V2 N019 GNDT 45m
D1 GNDT DMG BZX84B10VLY
SW1 CS N026 N029 GNDT TOFLEB
SW2 GNDT N026 N030 GNDT TOFLEB
A1 N027 GNDT GNDT GNDT GNDT N028 GNDT GNDT BUF Vhigh=5 Vlow=0 Ref=2.5
V1 N007 GNDT {Ineg}
R1 INEG GNDT 1Meg
A2 GNDT N016 GNDT N020 GNDT GNDT N017 GNDT OR Vhigh=5 Vlow=0 Ref=2.5
A3 GNDT DRVB GNDT N006 GNDT GNDT N020 GNDT AND Vhigh=5 Vlow=0 Ref=2.5
X§X7 DRV GNDT N027 small_pulse_leb params: Tleb=100n
V3 N001 GNDT 3
I1 0 N003 25µ
C1 N003 GNDT 1n
SW3 GNDT N003 DRV GNDT TOFLEB
A4 GNDT N002 GNDT N013 GNDT GNDT N010 GNDT OR Vhigh=5 Vlow=0 Ref=2.5
VSS SS GNDT PWL(0 100m {TSS} 1)
V4 N004 GNDT 1
I2 0 N005 1µ
C2 N005 GNDT {Cton}
SW4 GNDT N005 DRVB GNDT TOFLEB
A5 GNDT N025 GNDT maxTon GNDT GNDT N018 GNDT OR Vhigh=5 Vlow=0 Ref=2.5 Td=100n
R2 N029 N028 10
R5 N030 N027 10
C5 N030 GNDT 10p
C6 N029 GNDT 10p
X§X10 N001 N003 N002 GNDT comptof_g params: VHIGH=5 VLOW=100m VHYS=10m
X§X1 INEG N007 N006 GNDT comptof_g params: VHIGH=5 VLOW=100m VHYS=10m
X§X4 DMG N019 N016 GNDT comptof_g params: VHIGH=5 VLOW=100m VHYS=20m
X§X3 N004 N005 maxTon GNDT comptof_g params: VHIGH=5 VLOW=100m VHYS=10m
X§X8 N024 N026 N025 GNDT comptof_g params: VHIGH=5 VLOW=100m VHYS=10m
X§X9 N023 FB GNDT CMP op_amp_fan_out params: gain={gain} pole={pole} Isink={Isink} Isource={Isource} Vlow={VOL} Vhigh={VOH}
X§X5 N009 N017 N013 NC_01 GNDT N008 d_flipflop_g_rst
X§X2 N018 N010 N008 N009 GNDT sr_latch_g
*
.model TOFLEB SW (Ron=10 Roff=10Meg Vt=2 Vh=1)
.param Cton={1u*Maxton/1} ; max ton reset time
*
* This is a 100-µs watchdog which
* starts the circuit in case the
* demag is missing (at start-up
* for instance).
.ends generic_cm_qr_ahb_pwm

.subckt small_pulse_leb IN GNDT OUT
A1 GNDT IN GNDT N001 GNDT GNDT OUT GNDT AND Vhigh=5 Vlow=100m Ref=2.5
A2 GNDT IN GNDT IN GNDT N001 GNDT GNDT AND Vhigh=5 Vlow=100m Ref=2.5 TD={TLEB}
* This subcircuit generates a single narrow pulse
* at the rising edge of the input
.ends small_pulse_leb

.subckt comptof_g INV NINV OUT G
B1 HYS NINV V=IF(V(out) > ({VHIGH}+{VLOW})/2,{VHYS},0)
B2 N001 G V=IF(V(HYS,INV)>0,{VHIGH},{VLOW})
R1 N001 OUT 10
C1 OUT G 10p
R2 INV G 1Meg
.ends comptof_g

.subckt op_amp_fan_out + - Masse OUT
G1 Masse N004 + - 100µ
R1 N004 Masse {GAIN/100u}
C1 N004 Masse {1/(6.28*(GAIN/100u)*POLE)}
D1 Masse N004 dopamp
E1 N005 Masse N004 Masse 1
D3 N005 N006 dopamp
I1 N006 Masse {ISINK/185}
Q1 Masse N006 N003 0 2N3906
V1 OUT N003 {VLOW-700m}
I2 N002 OUT {Isource}
D4 OUT N002 dopamp
V3 N001 Masse {VHIGH}
D2 N004 N002 dopamp
R2 N002 N001 10
*
.model dopamp D RS=1m VFWD=1m TT=10n Cjo=10p
*
.ends op_amp_fan_out

.subckt d_flipflop_g_rst D CLK Q Qb G RST
A1 G D G D G N004 G G AND Vhigh=5 Vlow=100m Ref=2.5 TD=10n
BQ1 N001 G V=If((V(R2,G)<2.5) & ((V(S2,G)>2.5) | (V(Qb,G)<2.5)),5,100m)
R1 Q N001 30
C1 Q G 100p IC=0
BQB1 N002 G V=If((V(R2,G)>2.5) | ((V(Q,G)<2.5) & (V(S2,G)<2.5)),5,100m)
R2 Qb N002 30
C2 Qb G 100p IC=5
BQ2 N006 G V=If((V(R1,G)<2.5) & ((V(S1,G)>2.5) | (V(Qb,G)<2.5)),5,100m)
R3 Q1 N006 100
C3 Q1 G 70p IC=0
BQB2 N007 G V=If((V(R1,G)>2.5) | ((V(Q1,G)<2.5) & (V(S1,G)<2.5)),5,100m)
R4 QB1 N007 100
C4 QB1 G 70p IC=5
A2 G D G N003 G G S1 G AND Vhigh=5 Vlow=100m Ref=2.5 TD=10n
A3 G N004 G N003 G G R1 G AND Vhigh=5 Vlow=100m Ref=2.5 TD=10n
A4 G Q1 G CLK G G S2 G AND Vhigh=5 Vlow=100m Ref=2.5 TD=10n
A5 G CLK G QB1 G G N005 G AND Vhigh=5 Vlow=100m Ref=2.5 TD=10n
A6 G CLK G CLK G N003 G G AND Vhigh=5 Vlow=100m Ref=2.5 TD=10n
A7 G N005 G RST G G R2 G OR Vhigh=5 Vlow=0 Ref=2.5
.tran 0 100u 0 20n uic
.ends d_flipflop_g_rst

.subckt sr_latch_g R S Q Qb G
BQ a G V=If((V(R,G)<2.5) & ((V(S,G)>2.5) | (V(Qb,G)<2.5)),5,100m)
R1 R G 1Meg
R2 S G 1Meg
R3 Q a 10
C1 Q G 10p IC=0
BQB b G V=If((V(R,G)>2.5) | ((V(Q,G)<2.5) & (V(S,G)<2.5)),5,100m)
R4 Qb b 10
C2 Qb G 10p IC=5
.ends sr_latch_g

.subckt optotof A K C E
F1 N002 E Vf {CTR}
rd N001 A {rd}
Vf N001 K 1.05
V1 C N002 100m
C1 N002 E {Copto}
D1 E N002 Dopto
.model Dopto D tt=100n Rs=10m N=100m
.model DLED D N=1
.ends optotof

.subckt xfmr_3w 1 2 3 4 5 6
B1 1 2 I=I(V1)*{ratio12}+I(V2)*{ratio13}
B2 N001 4 V=V(1,2)*{ratio12}
V1 N001 N002 0
R1 3 N002 1µ
R2 1 2 1Meg
B3 N003 6 V=V(1,2)*{ratio13}
V2 N003 N004 0
R3 5 N004 1µ
.ends xfmr_3w

.model D D
.lib standard.dio
.model NPN NPN
.model PNP PNP
.lib standard.bjt
.model NMOS NMOS
.model PMOS PMOS
.lib standard.mos
.tran 0 3m 0 100n uic
;.op
*
.param AOL=90
.param GAIN={10**(AOL/20)}
.param pole=30
.param Isink=20m
.param Isource=500u
.param VOL=100m
.param VOH=3
*
.param Vref=2.5
.param Tss=1m
*
*
.param Dutymax=0.8
.param DT=150n
.param VDRV=12
.param VCS=437m
.param Ineg=-0.7
.param Maxton=12u
*
.options abstol=1u vntol=1m reltol=0.01 gmin=100p
+method=gear
.backanno
.end